# Altium schematic sheet RS485.SchDoc
size A4; SheetNumber: 5; SheetTotal: 11
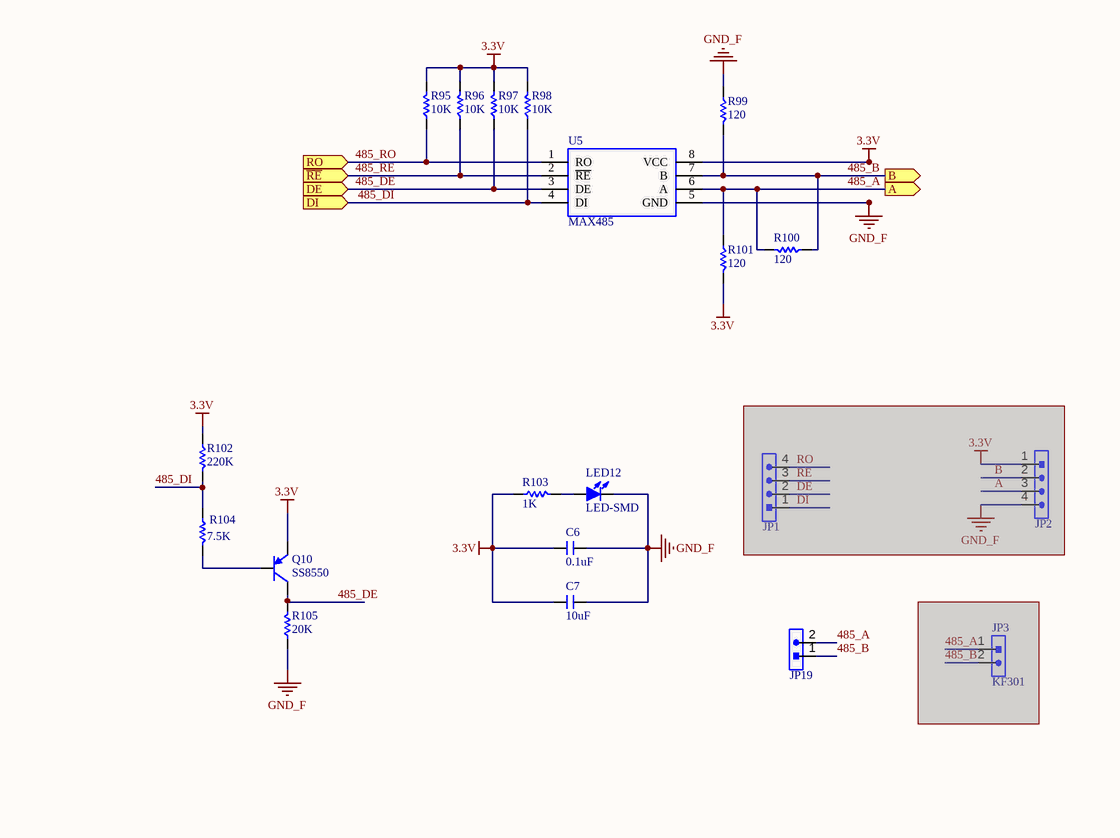
[diagram p0: RS485.SchDoc]

## Parts
C6  0.1uF  [C 0805]
C7  10uF  [C 1206]
JP1  HDR-1X4  [HDR-1X4]  (value not drawn)  (masked out: inside a compile mask, not in the netlist)
JP2  HDR-1X4  [HDR-1X4]  (value not drawn)  (masked out: inside a compile mask, not in the netlist)
JP3  KF301  [KF301-2P]  (masked out: inside a compile mask, not in the netlist)
JP19  HDR-1X2  [KF2EDGK-2P_H_5.08]  (value not drawn)
LED12  LED-SMD  [LED 0805R]
Q10  SS8550  [SOT23-3N]
R95  10K  [R 0805]
R96  10K  [R 0805]
R97  10K  [R 0805]
R98  10K  [R 0805]
R99  120  [R 0805]
R100  120  [R 0805]
R101  120  [R 0805]
R102  220K  [R 0805]
R103  1K  [R 0805]
R104  7.5K  [R 0805]
R105  20K  [R 0805]
U5  MAX485  [SOP8_N]

## Ports
A (out), B (out), DE (in), DI (in), RO (in), ~{RE} (in)

## Nets
3.3V: C6.1 C7.1 Q10.2(E) R95.2 R96.2 R97.2 R98.2 R101.2 R102.1 R103.1 U5.8(VCC)
GND_F: C6.2 C7.2 LED12.2(K) R99.1 R105.1 U5.5(GND)
485_A: JP19.2 R100.2 R101.1 U5.6(A) ; port A
485_B: JP19.1 R99.2 R100.1 U5.7(B) ; port B
485_DE: Q10.3(C) R97.1 R105.2 U5.3(DE) ; port DE
485_DI: R98.1 R102.2 R104.1 U5.4(DI) ; port DI
485_~{RE}: R96.1 U5.2(~{RE}) ; port ~{RE}
485_RO: R95.1 U5.1(RO) ; port RO
NetLED12_1: LED12.1(A) R103.2
NetQ10_1: Q10.1(B) R104.2

## Library data of the parts
C6 C7 = C: Non-polar patch capacitor; BOM名称: 无极性贴片电容; 版权归属: 源创客; 学习资源: www.ooocke.com
JP1 JP2 = Header 4: 4P Connector; BOM名称: 4P接插件; 版权归属: 源创客; 学习资源: www.ooocke.com
JP3 JP19 = Header 2: 2P Connector; BOM名称: 2P接插件; 版权归属: 源创客; 学习资源: www.ooocke.com
LED12 = LED-SMD: Patch LED; BOM名称: 贴片LED; 版权归属: 源创客; 学习资源: www.ooocke.com
Q10 = 8550-SMD: High Frequency Amplifier-PNP; BOM名称: 高频放大-PNP型; 版权归属: 源创客; 属性: 40V 1.5A 1W 100MHZ; 学习资源: www.ooocke.com
R95-R105 = R: Chip resistor; 版权归属: 源创客; BOM名称: Chip resistor; 学习资源: www.ooocke.com
U5 = MAX485: RS485/RS422 Transceivers; BOM名称: MAX232; 版权归属: 源创客; 学习资源: www.ooocke.com